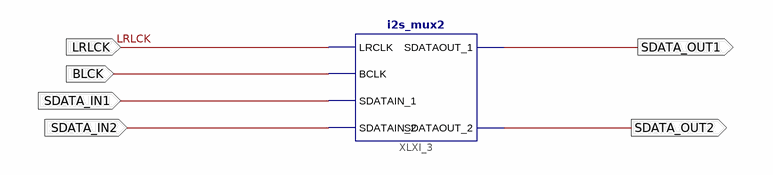
[diagram p0: schematic sheet 1]
// Xilinx ISE schematic i2s_mux_top.sch (spartan6) as structural Verilog: 1 symbols, 6 ports
module i2s_mux_top (
  input  LRLCK,
  input  BLCK,
  input  SDATA_IN1,
  input  SDATA_IN2,
  output SDATA_OUT1,
  output SDATA_OUT2
);

  i2s_mux2 XLXI_3 (
    .LRCLK(LRLCK), .BCLK(BLCK), .SDATAIN_1(SDATA_IN1), .SDATAIN_2(SDATA_IN2), .SDATAOUT_1(SDATA_OUT1),
    .SDATAOUT_2(SDATA_OUT2));
endmodule
